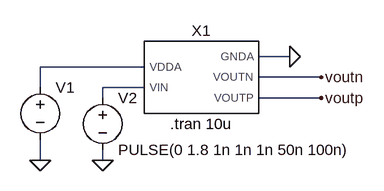
[diagram p0: schematic tb_Digital_Circuits.asc]
tb_Digital_Circuits.asc, the LTspice schematic file:
Version 4
SHEET 1 880 680
WIRE 368 160 320 160
WIRE 144 176 -16 176
WIRE 416 192 320 192
WIRE -16 208 -16 176
WIRE 144 208 80 208
WIRE 80 224 80 208
WIRE 416 224 320 224
WIRE -16 320 -16 288
WIRE 80 320 80 304
FLAG -16 320 0
FLAG 80 320 0
FLAG 368 160 0
FLAG 416 192 voutn
FLAG 416 224 voutp
SYMBOL voltage -16 192 R0
WINDOW 3 24 96 Invisible 2
WINDOW 123 0 0 Left 0
WINDOW 39 0 0 Left 0
SYMATTR InstName V1
SYMATTR Value PULSE(0 1.8 1n)
SYMBOL voltage 80 208 R0
WINDOW 123 0 0 Left 0
WINDOW 39 0 0 Left 0
SYMATTR InstName V2
SYMATTR Value PULSE(0 1.8 1n 1n 1n 50n 100n)
SYMBOL Digital_Circuits 224 192 R0
SYMATTR InstName X1
TEXT 184 264 Left 2 !.tran 10u

digital_circuits.asc, the sub-circuit schematic file:
Version 4
SHEET 1 4036 800

The netlist it stands for:
* tb_Digital_Circuits.asc
V1 N001 0 PULSE(0 1.8 1n)
V2 N002 0 PULSE(0 1.8 1n 1n 1n 50n 100n)
XX1 N001 N002 0 voutn voutp digital_circuits

* block symbol definitions
.subckt digital_circuits VDDA VIN GNDA VOUTN VOUTP
.ends digital_circuits

.tran 10u
.backanno
.end